# Altium schematic sheet Dot Matrix Display Driver.SchDoc
size A4
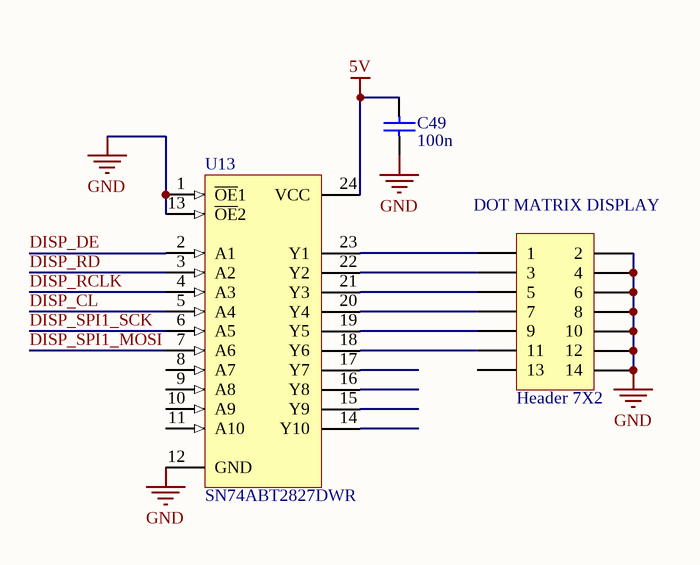
[diagram p0: Dot Matrix Display Driver.SchDoc]

## Parts
C49  value 100n  [0805C-GENERIC]  (hidden comment: Cap Semi)
DOT_MATRIX_DISPLAY  Header 7X2  [IDC14-B]
U13  SN74ABT2827DWR  [SOIC24]

## Nets
5V: C49.2 U13.24(VCC)
GND: C49.1 DOT_MATRIX_DISPLAY.2 DOT_MATRIX_DISPLAY.4 DOT_MATRIX_DISPLAY.6 DOT_MATRIX_DISPLAY.8 DOT_MATRIX_DISPLAY.10 DOT_MATRIX_DISPLAY.12 DOT_MATRIX_DISPLAY.14 U13.1(~{OE}1) U13.12(GND) U13.13(~{OE}2)
DISP_CL: U13.5(A4)
DISP_DE: U13.2(A1)
DISP_RCLK: U13.4(A3)
DISP_RD: U13.3(A2)
DISP_SPI1_MOSI: U13.7(A6)
DISP_SPI1_SCK: U13.6(A5)
NetDOT_MATRIX_DISPLAY_1: DOT_MATRIX_DISPLAY.1 U13.23(Y1)
NetDOT_MATRIX_DISPLAY_3: DOT_MATRIX_DISPLAY.3 U13.22(Y2)
NetDOT_MATRIX_DISPLAY_5: DOT_MATRIX_DISPLAY.5 U13.21(Y3)
NetDOT_MATRIX_DISPLAY_7: DOT_MATRIX_DISPLAY.7 U13.20(Y4)
NetDOT_MATRIX_DISPLAY_9: DOT_MATRIX_DISPLAY.9 U13.19(Y5)
NetDOT_MATRIX_DISPLAY_11: DOT_MATRIX_DISPLAY.11 U13.18(Y6)

Not connected (* = marked no-connect by the designer): DOT_MATRIX_DISPLAY 13; U13 8(A7) 9(A8) 10(A9) 11(A10) 14(Y10) 15(Y9) 16(Y8) 17(Y7)

## Library data of the parts
C49 = Cap Semi: Capacitor (Semiconductor SIM Model); Published: 8-Jun-2000; LatestRevisionDate: 29-May-2009; LatestRevisionNote: IPC-7351 Footprint Added.; PackageReference: C1206; Publisher: Altium Limited; PackageDescription: Chip Capacitor
DOT_MATRIX_DISPLAY = Header 7X2: Header, 7-Pin, Dual row; LatestRevisionDate: 17-Jul-2002; LatestRevisionNote: Re-released for DXP Platform.; Publisher: Altium Limited
U13 = SN74LVC827ADW: 10-Bit Buffer/Driver with 3-State Outputs; Published: 8-Jun-2000; LatestRevisionDate: 13-Apr-2006; LatestRevisionNote: IPC-7351 Footprint Added.; DatasheetVersion: Jun-1998; PackageVersion: Mar-2000; PackageReference: DW024; Publisher: Altium Limited; PackageDescription: 24-Pin Plastic Small Outline Integrated Circuit 1.27 mm Pitch; Code_JEDEC: MS-013; ComponentLink1Description: Manufacturer Link; ComponentLink1URL: http://www.ti.com/; ComponentLink2Description: Datasheet; ComponentLink2URL: http://www-s.ti.com/sc/ds/sn74lvc827a.pdf